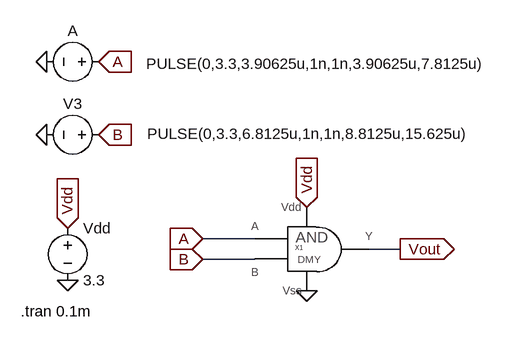
[diagram p0: schematic AND_test.asc]
AND_test.asc, the LTspice schematic file:
Version 4
SHEET 1 880 680
WIRE 144 144 64 144
WIRE 368 160 320 160
WIRE 144 176 64 176
FLAG -176 -16 0
FLAG -176 -128 0
FLAG -144 208 0
FLAG -96 -128 A
IOPIN -96 -128 In
FLAG -96 -16 B
IOPIN -96 -16 In
FLAG -144 128 Vdd
IOPIN -144 128 In
FLAG 64 144 A
IOPIN 64 144 In
FLAG 64 176 B
IOPIN 64 176 In
FLAG 224 96 Vdd
IOPIN 224 96 In
FLAG 368 160 Vout
IOPIN 368 160 Out
FLAG 224 224 0
SYMBOL voltage -144 112 R0
WINDOW 123 0 0 Left 0
WINDOW 39 0 0 Left 0
SYMATTR InstName Vdd
SYMATTR Value 3.3
SYMBOL voltage -80 -128 R90
WINDOW 0 -32 56 VBottom 2
WINDOW 3 -13 -320 VTop 2
WINDOW 123 0 0 Left 0
WINDOW 39 0 0 Left 0
SYMATTR InstName A
SYMATTR Value PULSE(0,3.3,3.90625u,1n,1n,3.90625u,7.8125u)
SYMBOL voltage -80 -16 R90
WINDOW 0 -32 56 VBottom 2
WINDOW 3 -17 -308 VTop 2
WINDOW 123 0 0 Left 0
WINDOW 39 0 0 Left 0
SYMATTR InstName V3
SYMATTR Value PULSE(0,3.3,6.8125u,1n,1n,8.8125u,15.625u)
SYMBOL AND 256 160 R0
SYMATTR InstName X1
TEXT -216 256 Left 2 !.tran 0.1m

The netlist it stands for:
* AND_test.asc
Vdd Vdd 0 3.3
V§A A 0 PULSE(0,3.3,3.90625u,1n,1n,3.90625u,7.8125u)
V3 B 0 PULSE(0,3.3,6.8125u,1n,1n,8.8125u,15.625u)
XX1 A B 0 Vdd Vout AND  ; pins A B Vss Vdd Y
.tran 0.1m
.backanno
.end

* Results of the author's LTspice run, read from the files saved beside the schematic
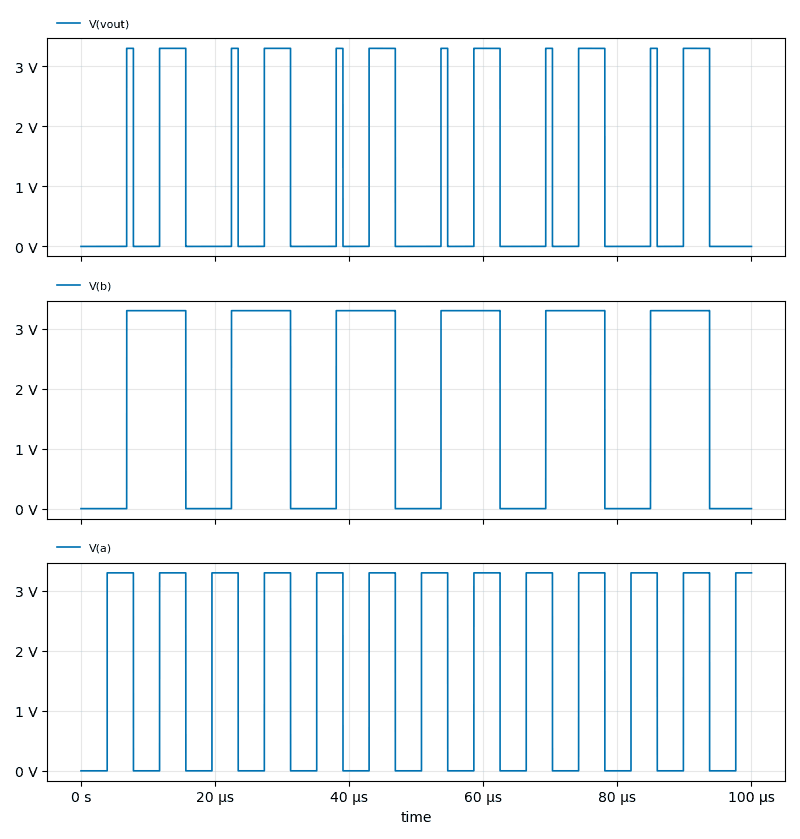
[diagram p1: Transient Analysis of AND_test.asc, plotted from the saved traces]
* Transient Analysis, 1 run:
*   V(vout): min 0 V, max 3.3 V, average 971.8 mV, rms 1.791 V, last 0 V
*   V(b): min 0 V, max 3.302 V, average 1.745 V, rms 2.4 V, last 0 V
*   V(a): min 0 V, max 3.302 V, average 1.625 V, rms 2.315 V, last 3.3 V